# EasyEDA Pro project ZeptoWatch.eprj, schematic Schematic3
Create Date: 2022-11-16; Page Name: P1; Project Name: ZeptoWatch; Schematic Name: Schematic3; Update Date: 2022-11-27; Company: 嘉立创EDA; Page Size: A2; Version: V1.0
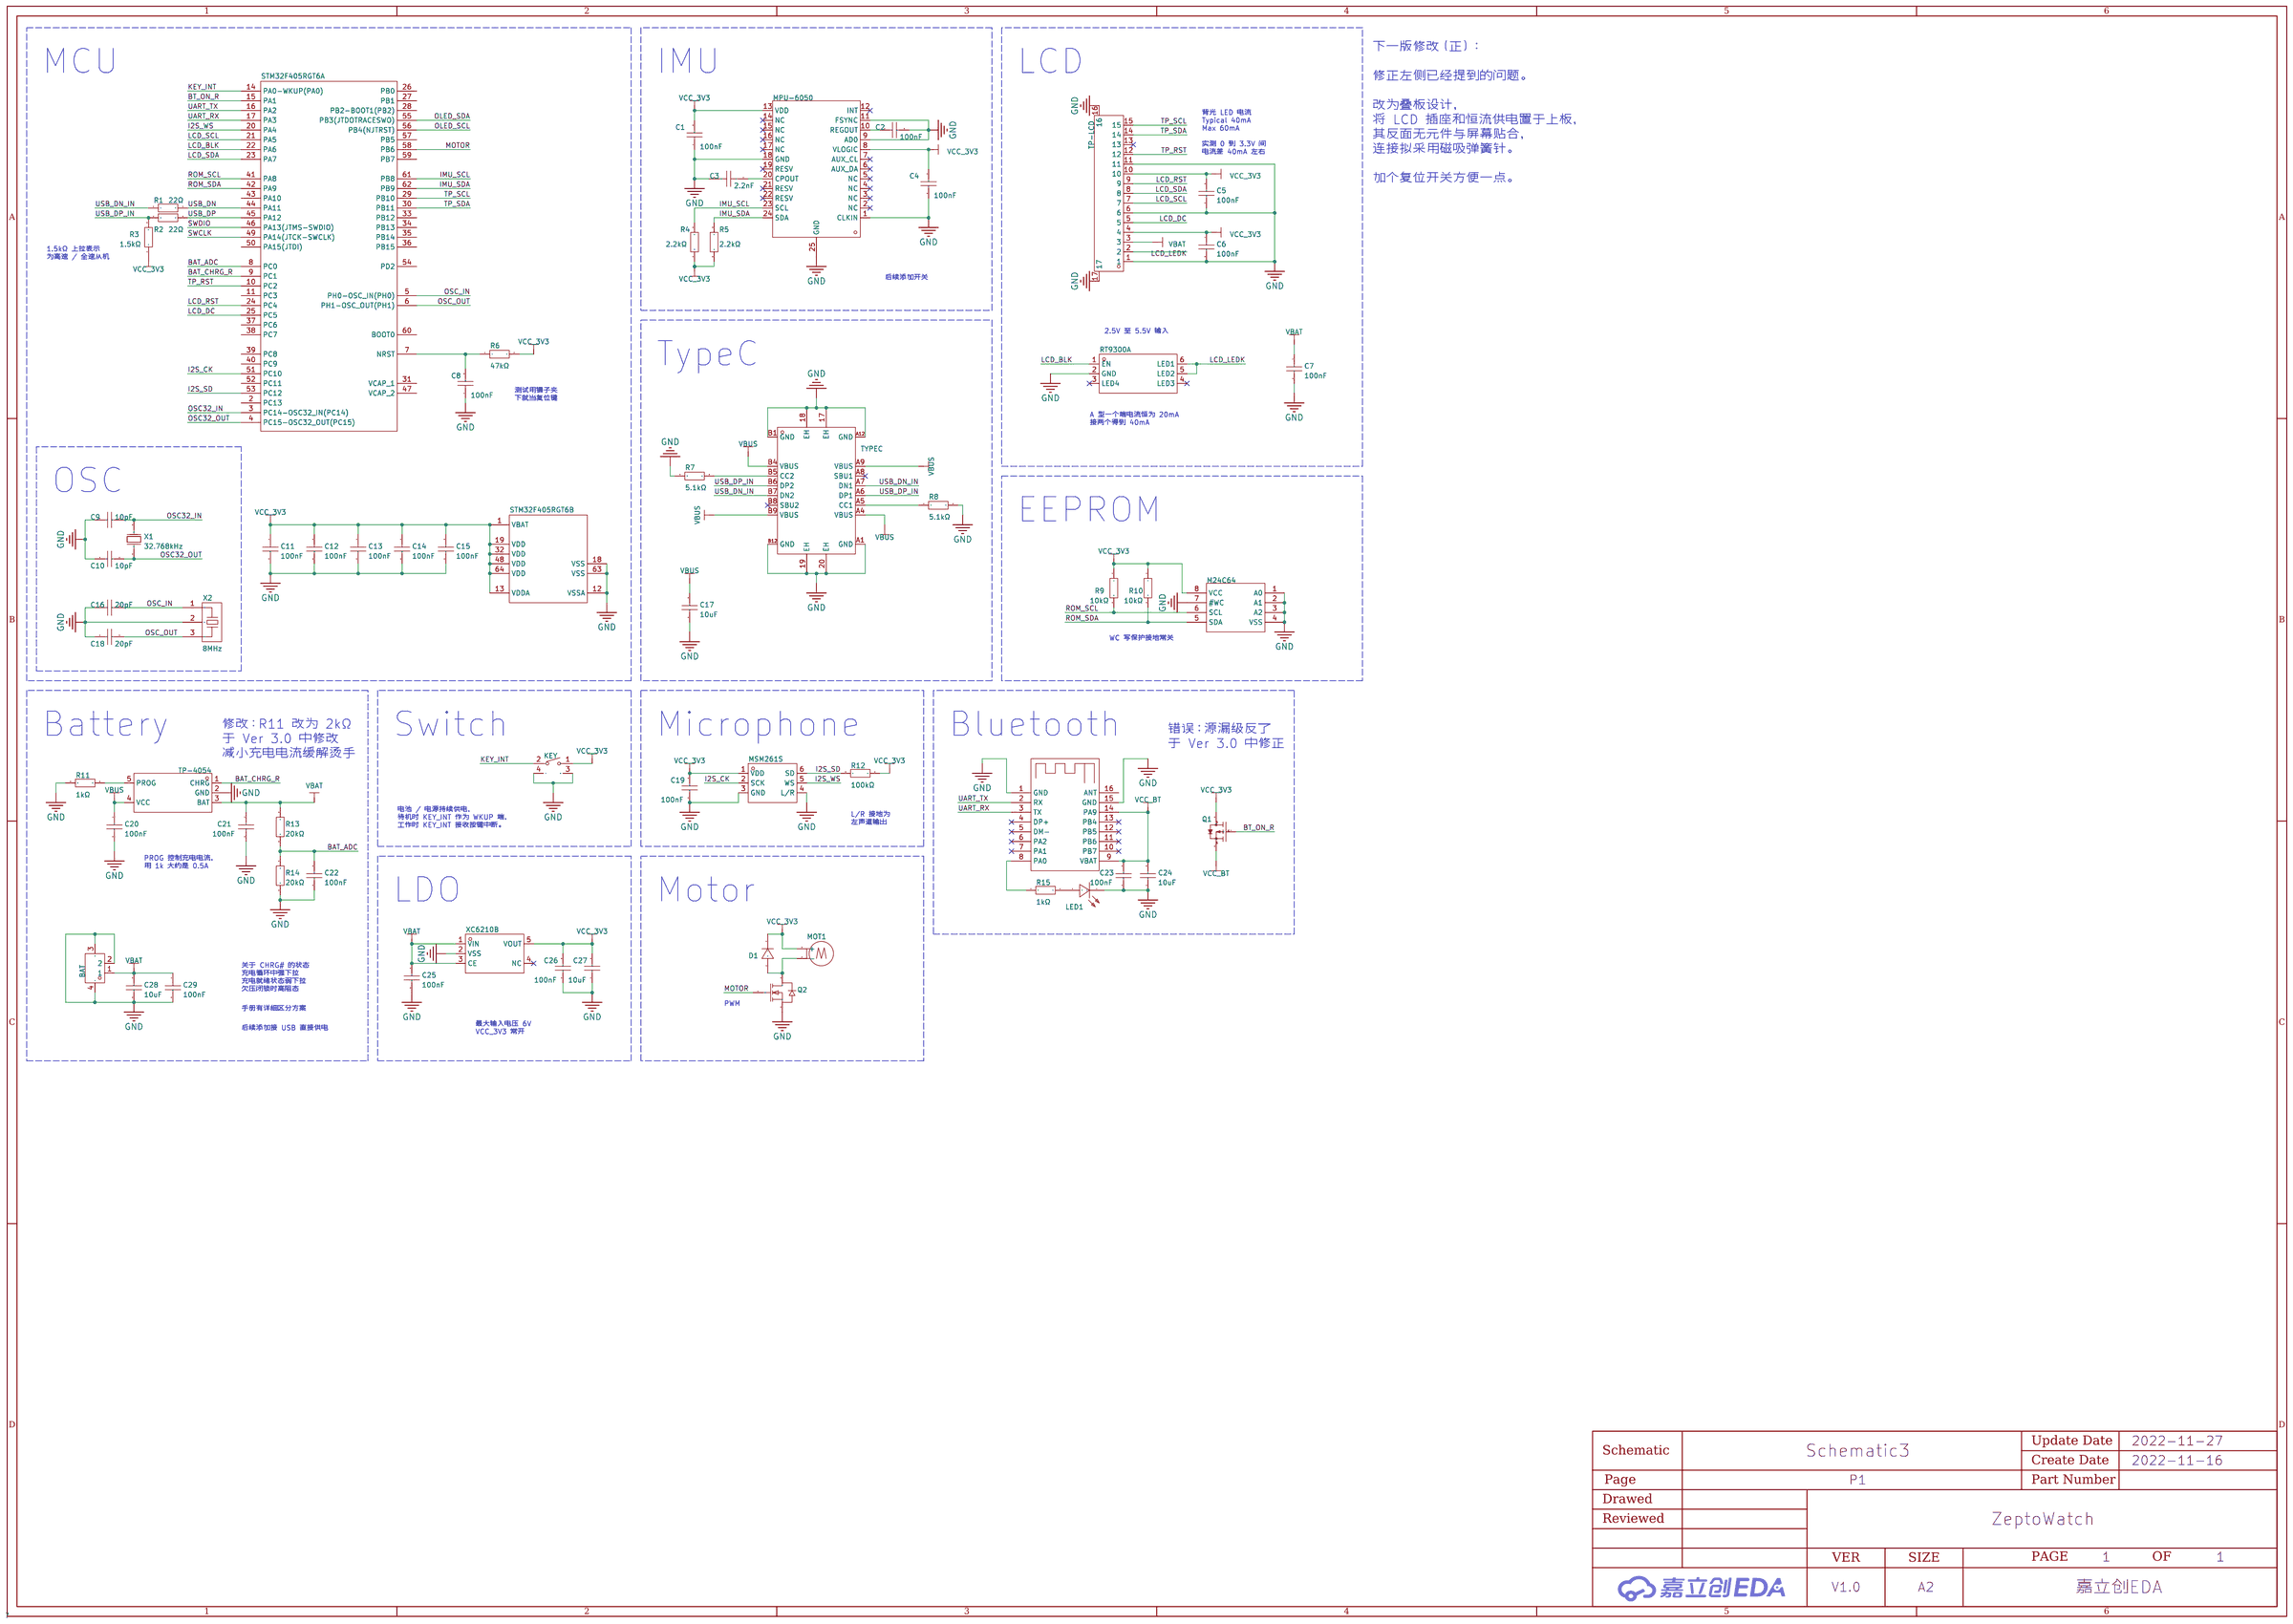
[diagram p2: schematic sheet]

## Parts
BAT  1.25K-CB-2PWB  [CONN-SMD_2P-P1.25_L5.5-W7.7-2PWB]
BT-11  -  [BT-11]
C1  100nF  [C0402]
C2  100nF  [C0402]
C3  2.2nF  [C0402]
C4  100nF  [C0402]
C5  100nF  [C0402]
C6  100nF  [C0402]
C7  100nF  [C0402]
C8  100nF  [C0402]
C9  10pF  [C0402]
C10  10pF  [C0402]
C11  100nF  [C0402]
C12  100nF  [C0402]
C13  100nF  [C0402]
C14  100nF  [C0402]
C15  100nF  [C0402]
C16  20pF  [C0402]
C17  10uF  [C0402]
C18  20pF  [C0402]
C19  100nF  [C0402]
C20  100nF  [C0402]
C21  100nF  [C0402]
C22  100nF  [C0402]
C23  100nF  [C0402]
C24  10uF  [C0402]
C25  100nF  [C0402]
C26  100nF  [C0402]
C27  10uF  [C0402]
C28  10uF  [C0402]
C29  100nF  [C0402]
D1  B5819WS  [SOD-323_L1.8-W1.3-LS2.5-FD]
KEY  TS-KG012EV  [SW-SMD_TS-KG012EV]
LED1  D-060306B1  [LED0603-RD]
M24C64  M24C64-RMN6TP  [SOIC-8_L5.0-W4.0-P1.27-LS6.0-BL]
MOT1  LCM1027A2445F  [VIBRATING-MOTOR-SMD_WELDING]
MPU-6050  MPU-6050  [QFN-24_L4.0-W4.0-P0.50-BL-EP2.7]
MSM261S  MSM261S3526Z0CM  [MIC-SMD_6P-L3.5-W2.7-P0.90-TR]
Q1  AO3401  [SOT-23-3_L2.9-W1.3-P1.90-LS2.4-BR]
Q2  AO3400A  [SOT-23-3_L2.9-W1.6-P1.90-LS2.8-BR]
R1  22Ω  [R0402]
R2  22Ω  [R0402]
R3  1.5kΩ  [R0402]
R4  2.2kΩ  [R0402]
R5  2.2kΩ  [R0402]
R6  47kΩ  [R0402]
R7  5.1kΩ  [R0402]
R8  5.1kΩ  [R0402]
R9  10kΩ  [R0402]
R10  10kΩ  [R0402]
R11  1kΩ  [R0402]
R12  100kΩ  [R0402]
R13  20kΩ  [R0402]
R14  20kΩ  [R0402]
R15  1kΩ  [R0402]
RT9300A  -  [SOT-23-6_L2.9-W1.6-P0.95-LS2.8-BR]
STM32F405RGT6  STM32F405RGT6  [LQFP-64_L10.0-W10.0-P0.50-LS12.0-BL]  (sections 1,2)
TP-4054  TP4054-42-SOT25R  [SOT-23-5_L3.0-W1.7-P0.95-LS2.8-BR]
TP-LCD  KH-FG0.5-H2.0-15PIN  [FPC-SMD_15P-P0.50_KINGHELM_KH-FG0.5-H2.0-15PIN]
TYPEC  TYPE-C-16M-005  [USB-C-SMD_TYPE-C-16M-005]
X1  32.768kHz  [OSC-SMD_L3.2-W1.5]
X2  8MHz  [OSC-SMD_3P-L3.2-W1.3-P1.2-L]
XC6210B  XC6210B332MR  [SOT-25_L3.0-W1.6-P0.95-LS2.8-BL]

## Library data of the parts
BAT = 1.25K-CB-2PWB: 参考系列:-;间距:1.25mm;插针结构:1x2P;排数:1;每排PIN数:2;行距:-;公母:公型插针;安装方式:卧贴;额定电流:1A;工作温度范围:-25~+85;; LCSC Part Name: 1x2P 间距P=1.25mm 超薄针座 超薄; Supplier Part: C2919570; Manufacturer: HDGC(华德共创); Supplier Footprint: SMD,P=1.25mm; JLCPCB Part Class: 扩展库; Datasheet: https://atta.szlcsc.com/upload/public/pdf/source/20211115/F776F48743F73668B48ED2809AC4027A.pdf; Supplier: LCSC; Pitch: 1.25mm; Pins Structure: 1x2P; Number of Rows: 1; Number of PINs Per Row: 2; Gender: 公型插针; Mounting Style: 卧贴; Current Rating (Max): 1A; Operating Temperature Range: -25~+85
BT-11 = BT-11
C1 C2 C4-C8 C11-C15 C19-C23 C25 C26 C29 = CC0402KRX7R9BB104: 容值:100nF;精度:±10%;额定电压:50V;材质(温度系数):X7R;; LCSC Part Name: 100nF ±10% 50V; Supplier Part: C131394; Manufacturer: YAGEO(国巨); Supplier Footprint: 0402; JLCPCB Part Class: 扩展库; Datasheet: https://atta.szlcsc.com/upload/public/pdf/source/20170925/C131394_1506321459057990237.pdf; Supplier: LCSC; Tolerance: ±10%; Voltage Rated: 50V; Temperature Coefficient: X7R
C3 = CC0402JRX7R9BB222: 温度系数:X7R;容值:2.2nF;电容体长:-;电容体宽:-;电容体厚度:-;精度:±5%;额定电压:50V;; LCSC Part Name: 2.2nF ±5% 50V; Supplier Part: C513667; Manufacturer: YAGEO(国巨); Supplier Footprint: 0402; JLCPCB Part Class: 扩展库; Datasheet: https://atta.szlcsc.com/upload/public/pdf/source/20200415/C513667_43ACA5E3BCCDD816EC65E9B61132137F.pdf; Supplier: LCSC; Temperature Coefficient: X7R; Tolerance: ±5%; Voltage Rated: 50V
C9 C10 = 0402CG100J500NT: 容值:10pF;精度:±5%;额定电压:50V;材质(温度系数):C0G;; LCSC Part Name: 10pF ±5% 50V; Supplier Part: C1545; Manufacturer: FH(风华); Supplier Footprint: 0402; JLCPCB Part Class: 扩展库; Datasheet: https://atta.szlcsc.com/upload/public/pdf/source/20170923/C1545_1506149264855988352.pdf; Supplier: LCSC; Tolerance: ±5%; Voltage Rated: 50V; Temperature Coefficient: C0G
C16 C18 = 0402CG200J500NT: 温度系数:C0G;容值:20pF;精度:±5%;额定电压:50V;; LCSC Part Name: 20pF(200) ±5% 50V; Supplier Part: C1554; Manufacturer: FH(风华); Supplier Footprint: 0402; JLCPCB Part Class: 基础库; Datasheet: https://atta.szlcsc.com/upload/public/pdf/source/20170923/C1554_1506149268708988361.pdf; Supplier: LCSC; Temperature Coefficient: C0G; Tolerance: ±5%; Voltage Rated: 50V
C17 C24 C27 C28 = CL05A106MQ5NUNC: 容值:10uF;精度:±20%;额定电压:6.3V;材质(温度系数):X5R;; LCSC Part Name: 10uF ±20% 6.3V; Supplier Part: C15525; Manufacturer: SAMSUNG(三星); Supplier Footprint: 0402; JLCPCB Part Class: 基础库; Datasheet: https://atta.szlcsc.com/upload/public/pdf/source/20220823/2B02EE04F8F211D38A52DCB16EB6BEBA.pdf; Supplier: LCSC; Tolerance: ±20%; Voltage Rated: 6.3V; Temperature Coefficient: X5R
D1 = B5819WS_C511873: 直流反向耐压(Vr):40V;平均整流电流(Io):1A;正向压降(Vf):900mV@3A;; LCSC Part Name: 40V 1A 900mV@3A; Supplier Part: C511873; Manufacturer: BORN伯恩半导体; Supplier Footprint: SOD-323; JLCPCB Part Class: 扩展库; Datasheet: https://atta.szlcsc.com/upload/public/pdf/source/20200413/C511871_84C991E4F87F9BC6B00A967897FF2061.pdf; Supplier: LCSC; Reverse Voltage (Vr): 40V; Average Rectified Current (Io): 1A; Forward Voltage (Vf@If): 900mV@3A
KEY = TS-KG012EV: 触点电流:50mA;额定电压(DC):12V;绝缘电阻:100MΩ;电路结构:单刀单掷;安装方式:卧插;按钮形状:矩形按钮;带灯:-;; LCSC Part Name: 轻触开关3*6*3.5侧按卧式 带柱; Supplier Part: C410363; Manufacturer: HANBO(汉博); Supplier Footprint: 插件,7.8x3.6x3.5mm; JLCPCB Part Class: 扩展库; Datasheet: https://atta.szlcsc.com/upload/public/pdf/source/20221110/2C1BC81D53AC7E4C4CC26C5BC87C8C3B.pdf; Supplier: LCSC; Contact Current: 50mA; Voltage Rating (DC): 12V; Insulation Resistance: 100MΩ; Circuit: 单刀单掷; Mounting Style: 卧插; Actuator Style: 矩形按钮
LED1 = D-060306B1: 发光颜色:蓝灯;; LCSC Part Name: 蓝色; Supplier Part: C118339; Manufacturer: 方舟 ARKLED; Supplier Footprint: 0603; JLCPCB Part Class: 扩展库; Datasheet: https://atta.szlcsc.com/upload/public/pdf/source/20190902/C118339_0F376D9FE53277D0A68A27C8339FB377.pdf; Supplier: LCSC; Emitted Color: 蓝灯
M24C64 = M24C64-RMN6TP: 存储器容量:64Kb (8K x 8);存储器接口类型:I2C;工作电压:1.8V ~ 5.5V;; Supplier Part: C79988; Manufacturer: ST(意法半导体); Supplier Footprint: SOIC-8_150mil; JLCPCB Part Class: 基础库; Datasheet: https://atta.szlcsc.com/upload/public/pdf/source/20160729/1469779585118.pdf; Supplier: LCSC; Memory Format: EEPROM; Memory Size: 64Kb (8K x 8); Memory Interface: I2C; Voltage - Supply: 1.8V ~ 5.5V
MOT1 = LCM1027A2445F: 类型:扁平振动马达;额定电压:3V;额定电流:80mA;额定转速:10000rpm;工作温度:-20~+60;旋转方向:CW；CCW;; LCSC Part Name: 扁平1027 振动马达; Supplier Part: C2759984; Manufacturer: LEADER(立得); JLCPCB Part Class: 扩展库; Datasheet: https://atta.szlcsc.com/upload/public/pdf/source/20210326/C2759984_5008EC97BD438BDFB6866D31635439F4.pdf; Supplier: LCSC; Type: 扁平振动马达; Rated Voltage: 3V; Rated Current: 80mA; Rated Speed: 10000rpm; Operating Temperature: -20~+60; Sense Of Rotation: CW；CCW
MPU-6050 = MPU-6050: 三轴加速度计和三轴陀螺仪，工作电压：2.375V~3.46V; Supplier Part: C24112; Manufacturer: TDK InvenSense(应美盛); Supplier Footprint: QFN-24_4x4x05P; JLCPCB Part Class: 扩展库; Datasheet: https://atta.szlcsc.com/upload/public/pdf/source/20140425/1457707046159.pdf; Supplier: LCSC
MSM261S = MSM261S3526Z0CM: Supplier Part: C966933; Manufacturer: MEMS(敏芯微); Supplier Footprint: SMD,3.5x2.65x0.98mm; JLCPCB Part Class: 扩展库; Datasheet: https://atta.szlcsc.com/upload/public/pdf/source/20210104/C966933_3269232C81BB891E12095FC7E88FC637.pdf; Supplier: LCSC
Q1 = AO3401_C181091: 类型:P沟道;漏源电压(Vdss):30V;连续漏极电流(Id):4.2A;功率(Pd):350mW;导通电阻(RDS(on)@Vgs,Id):65mΩ@10V,4.2A;阈值电压(Vgs(th)@Id):1.3V@250A;; LCSC Part Name: P沟道 30V 4.2A; Supplier Part: C181091; Manufacturer: Hottech(合科泰); Supplier Footprint: SOT-23(SOT-23-3); JLCPCB Part Class: 扩展库; Datasheet: https://atta.szlcsc.com/upload/public/pdf/source/20180131/C181091_15173931948391329220.pdf; Supplier: LCSC; Type: P沟道; Drain Source Voltage (Vdss): 30V; Continuous Drain Current (Id): 4.2A; Power Dissipation (Pd): 350mW; Drain Source On Resistance (RDS(on)@Vgs,Id): 65mΩ@10V,4.2A; Gate Threshold Voltage (Vgs(th)@Id): 1.3V@250A
Q2 = AO3400A_C20917: 类型:N沟道;漏源电压(Vdss):30V;连续漏极电流(Id):5.7A;功率(Pd):1.4W;导通电阻(RDS(on)@Vgs,Id):26.5mΩ@10V,5.7A;阈值电压(Vgs(th)@Id):1.5V@250A;; LCSC Part Name: N沟道 30V 5.7A; Supplier Part: C20917; Manufacturer: AOS; Supplier Footprint: SOT-23-3L; JLCPCB Part Class: 基础库; Datasheet: https://atta.szlcsc.com/upload/public/pdf/source/20140107/1457706668533.pdf; Supplier: LCSC; Type: N沟道; Drain Source Voltage (Vdss): 30V; Continuous Drain Current (Id): 5.7A; Power Dissipation (Pd): 1.4W; Drain Source On Resistance (RDS(on)@Vgs,Id): 26.5mΩ@10V,5.7A; Gate Threshold Voltage (Vgs(th)@Id): 1.5V@250A
R1 R2 = CR0402FF22R0G: 电阻类型:厚膜电阻;阻值:22Ω;精度:±1%;功率:1/16W;温度系数:±200ppm/;最大工作电压:50V;工作温度范围:-55~+125;; LCSC Part Name: 22Ω ±1%; Supplier Part: C100318; Manufacturer: LIZ(丽智电子); Supplier Footprint: 0402; Datasheet: https://atta.szlcsc.com/upload/public/pdf/source/20170408/1491621411980.pdf; Supplier: LCSC; Type: 厚膜电阻; Tolerance: ±1%; Power(Watts): 1/16W; Temperature Coefficient: ±200ppm/; Overload Voltage (Max): 50V; Operating Temperature Range: -55~+125
R3 = 0402WGF1501TCE: 阻值:1.5kΩ;精度:±1%;功率:1/16W;温度系数:±100ppm/;最大工作电压:50V;工作温度范围:-55~+155;; LCSC Part Name: 1.5KΩ ±1%; Supplier Part: C25867; Manufacturer: UNI-ROYAL(厚声); Supplier Footprint: 0402; JLCPCB Part Class: 基础库; Datasheet: https://atta.szlcsc.com/upload/public/pdf/source/20170920/C25867_1505895090394980874.pdf; Supplier: LCSC; Tolerance: ±1%; Power(Watts): 1/16W; Temperature Coefficient: ±100ppm/; Overload Voltage (Max): 50V; Operating Temperature Range: -55~+155
R4 R5 = RMC04022.2K5%N: 阻值:2.2kΩ;精度:±5%;功率:1/16W;; LCSC Part Name: 2.2kΩ ±5%; Supplier Part: C269678; Manufacturer: Tyohm(幸亚电阻); Supplier Footprint: 0402; JLCPCB Part Class: 扩展库; Datasheet: https://atta.szlcsc.com/upload/public/pdf/source/20190115/C269678_CFD168C224D6BF2B41E71AA235945392.pdf; Supplier: LCSC; Tolerance: ±5%; Power(Watts): 1/16W
R6 = 0402WGF4702TCE: 电阻类型:厚膜电阻;阻值:47kΩ;精度:±1%;功率:62.5mW;温度系数:±100ppm/;最大工作电压:50V;工作温度范围:-55~+155;; LCSC Part Name: 47kΩ ±1% 62.5mW; Supplier Part: C25792; Manufacturer: UNI-ROYAL(厚声); Supplier Footprint: 0402; JLCPCB Part Class: 基础库; Datasheet: https://atta.szlcsc.com/upload/public/pdf/source/20200306/C422600_1E6D84923E4A46A82E41ADD87F860B5C.pdf; Supplier: LCSC; Type: 厚膜电阻; Tolerance: ±1%; Power(Watts): 62.5mW; Temperature Coefficient: ±100ppm/; Overload Voltage (Max): 50V; Operating Temperature Range: -55~+155
R7 R8 = RC0402FR-075K1L: 阻值:5.1kΩ;精度:±1%;功率:62.5mW;温度系数:±100ppm/;最大工作电压:50V;工作温度范围:-55~+155;; LCSC Part Name: 5.1kΩ ±1% 62.5mW; Supplier Part: C105872; Manufacturer: YAGEO(国巨); Supplier Footprint: 0402; JLCPCB Part Class: 扩展库; Datasheet: https://atta.szlcsc.com/upload/public/pdf/source/20170912/C105872_1505207464555963229.pdf; Supplier: LCSC; Tolerance: ±1%; Power(Watts): 62.5mW; Temperature Coefficient: ±100ppm/; Overload Voltage (Max): 50V; Operating Temperature Range: -55~+155
R9 R10 = 0402WGF1002TCE: 电阻类型:厚膜电阻;阻值:10kΩ;精度:±1%;功率:62.5mW;温度系数:±100ppm/;最大工作电压:50V;工作温度范围:-55~+155;; LCSC Part Name: 10kΩ ±1% 62.5mW; Supplier Part: C25744; Manufacturer: UNI-ROYAL(厚声); Supplier Footprint: 0402; JLCPCB Part Class: 基础库; Datasheet: https://atta.szlcsc.com/upload/public/pdf/source/20200306/C422600_1E6D84923E4A46A82E41ADD87F860B5C.pdf; Supplier: LCSC; Type: 厚膜电阻; Tolerance: ±1%; Power(Watts): 62.5mW; Temperature Coefficient: ±100ppm/; Overload Voltage (Max): 50V; Operating Temperature Range: -55~+155
R11 R15 = 0402WGF1001TCE: 电阻类型:厚膜电阻;阻值:1kΩ;精度:±1%;功率:62.5mW;温度系数:±100ppm/;最大工作电压:50V;工作温度范围:-55~+155;; LCSC Part Name: 1kΩ ±1% 62.5mW; Supplier Part: C11702; Manufacturer: UNI-ROYAL(厚声); Supplier Footprint: 0402; JLCPCB Part Class: 基础库; Datasheet: https://atta.szlcsc.com/upload/public/pdf/source/20200306/C422600_1E6D84923E4A46A82E41ADD87F860B5C.pdf; Supplier: LCSC; Type: 厚膜电阻; Tolerance: ±1%; Power(Watts): 62.5mW; Temperature Coefficient: ±100ppm/; Overload Voltage (Max): 50V; Operating Temperature Range: -55~+155
R12 = AC0402FR-07100KL: 电阻类型:厚膜电阻;阻值:100kΩ;精度:±1%;功率:62.5mW;温度系数:±100ppm/;最大工作电压:50V;工作温度范围:-55~+155;; LCSC Part Name: 100kΩ ±1%; Supplier Part: C144809; Manufacturer: YAGEO(国巨); Supplier Footprint: 0402; JLCPCB Part Class: 扩展库; Datasheet: https://atta.szlcsc.com/upload/public/pdf/source/20171225/C144809_15141880836601203001.pdf; Supplier: LCSC; Type: 厚膜电阻; Tolerance: ±1%; Power(Watts): 62.5mW; Temperature Coefficient: ±100ppm/; Overload Voltage (Max): 50V; Operating Temperature Range: -55~+155
R13 R14 = RC-02W203JT: 阻值:20kΩ;精度:±5%;功率:62.5mW;温度系数:±200ppm/;最大工作电压:50V;工作温度范围:-55~+155;; LCSC Part Name: 20kΩ ±5% 62.5mW; Supplier Part: C258120; Manufacturer: FH(风华); Supplier Footprint: 0402; JLCPCB Part Class: 扩展库; Datasheet: https://atta.szlcsc.com/upload/public/pdf/source/20180730/C258120_EB2ABA5B79561D80B536831B08AD21D8.pdf; Supplier: LCSC; Tolerance: ±5%; Power(Watts): 62.5mW; Temperature Coefficient: ±200ppm/; Overload Voltage (Max): 50V; Operating Temperature Range: -55~+155
RT9300A = RT9300AGE: 类型:-;拓扑结构:-;内部开关:-;供电电压（最低）:-;供电电压（最高）:-;频率:-;; Supplier Part: C68151; Manufacturer: RICHTEK(台湾立锜); Supplier Footprint: SOT-23-6; JLCPCB Part Class: 扩展库; Datasheet: https://atta.szlcsc.com/upload/public/pdf/source/20180420/C68151_339603FDACFBF870F6D423A94B86B684.pdf; Supplier: LCSC
STM32F405RGT6 = STM32F405RGT6: 主频（MAX):168MHz;工作电压:1.8V ~ 3.6V;; Supplier Part: C15742; Manufacturer: ST(意法半导体); Supplier Footprint: LQFP-64_10x10x05P; JLCPCB Part Class: 扩展库; Datasheet: https://atta.szlcsc.com/upload/public/pdf/source/20140724/1457707160365.pdf; Supplier: LCSC; Speed: 168MHz; Voltage - Supply (Vcc/Vdd): 1.8V ~ 3.6V; Program Memory Size: 1MB; RAM Size: 192KB; Number of I/O: 51; A/D: 16x12bit; D/A: 2x12bit; PWM: 56; LCD: MOTOROLA 6800 AND INTEL  8080 TYPE LCD DIRECTLY; UART/USART: 4 USART+2 UART; SPI: 3; I2C（SMBUS/PMBUS）: 3; USB Device: 1; USB Host/OTG: 1; CAN: 2
TP-4054 = TP4054-42-SOT25R: 充电电池的类型:-;电池单元组数:-;最大充电电流:-;充满的电池组电压:-;最大供应电压:-;; Supplier Part: C32574; Manufacturer: TOPPOWER(南京拓微); Supplier Footprint: SOT-23-5; JLCPCB Part Class: 基础库; Datasheet: https://atta.szlcsc.com/upload/public/pdf/source/20140621/1457707095588.pdf; Supplier: LCSC
TP-LCD = KH-FG0.5-H2.0-15PIN: 间距:0.5mm;触点数量:15;锁定特性:翻盖式;安装类型:卧贴;触点类型:下接;工作温度范围:-25~+85;; LCSC Part Name: 0.5mm P数:15 翻盖式 下接; Supplier Part: C2925370; Manufacturer: kinghelm(金航标); Supplier Footprint: SMD,P=0.5mm; JLCPCB Part Class: 扩展库; Datasheet: https://atta.szlcsc.com/upload/public/pdf/source/20211126/ADAA9B198F87BAF60DF8D38208290934.pdf; Supplier: LCSC; Pitch: 0.5mm; Number of Contacts: 15; Locking Feature: 翻盖式; Mounting Type: 卧贴; Contact Type: 下接; Height Above Board: 2mm; FFC, FCB Thickness: 0.3mm; Operating Temperature Range: -25~+85
TYPEC = TYPE-C-16M-005: 连接器类型:-;标准:-;公母:-;触点数量:-;端口数量:-;安装方式:-;额定电流 - 电源:-;触头材质:-;触头镀层:-;工作温度范围:-;; Supplier Part: C2798173; Manufacturer: USAKRO(美韩); Supplier Footprint: SMD; Datasheet: https://atta.szlcsc.com/upload/public/pdf/source/20210415/C2798173_AFB22F19D04D65557371BF612B0225CF.pdf; Supplier: LCSC
X1 = X1A000141000300: 晶振类型:贴片无源晶振;频率:32.768kHz;频率公差:±20ppm;负载电容:12.5pF;等效串联电阻(ESR):-;工作温度:-40~+85;; LCSC Part Name: 32.768kHz ±20ppm 12.5pF; Supplier Part: C94276; Manufacturer: EPSON(爱普生); Supplier Footprint: SMD3215-2P; JLCPCB Part Class: 扩展库; Datasheet: https://atta.szlcsc.com/upload/public/pdf/source/20190322/C94276_5F77F140A1A8611EFF35496F1E5C1546.pdf; Supplier: LCSC; Crystal Type: 贴片无源晶振; Frequency Tolerance: ±20ppm; Load Capacitance: 12.5pF; Operating Temperature: -40~+85
X2 = CSTCE8M00G15C99-R0: 频率:8MHz;频率容差:±0.1%;内藏负载电容:33pF;谐振阻抗:40Ω;; LCSC Part Name: 8M ±0.1% 33pF; Supplier Part: C110614; Manufacturer: muRata(村田); Supplier Footprint: SMD3213-3P; JLCPCB Part Class: 扩展库; Datasheet: https://atta.szlcsc.com/upload/public/pdf/source/20180327/C110614_9F5031E08ADB10DE4472527BF78A8CAF.pdf; Supplier: LCSC; Frequency Stability: ±0.13%; Frequency Tolerance: ±0.1%; Built-in Load Capacitance: 33pF; Resonant Impedance: 40Ω; Operating Temperature: -40~+125
XC6210B = XC6210B332MR_C424705: 输出类型:固定;输出极性:正;输出通道数:1;最大输入电压:6V;输出电压:3.3V;压差:75mV@(100mA);输出电流:900mA;电源纹波抑制比(PRSS):60dB@(1kHz);; LCSC Part Name: Vin=6V Vout=3.3V 900mA 60dB@(1kHz); Supplier Part: C424705; Manufacturer: TOREX(特瑞仕); Supplier Footprint: SOT-25; JLCPCB Part Class: 扩展库; Datasheet: https://atta.szlcsc.com/upload/public/pdf/source/20190903/C424705_1DFB2113A9A78D399905DBF688657204.pdf; Supplier: LCSC; Output Type: 固定; Output Polarity: 正; Number of Outputs: 1; Maximum Input Voltage: 6V; Output Voltage: 3.3V; Dropout Voltage: 75mV@(100mA); Output Current: 900mA; Power Supply Rejection Ratio (PRSS): 60dB@(1kHz)

## Nets
GND: BAT.2 BAT.3 BAT.4 BT-11.1(GND) BT-11.15(GND) C1.1 C2.2 C3.2 C4.1 C5.2 C6.2 C7.2 C8.1 C9.1 C10.1 C11.2 C12.2 C13.2 C14.2 C15.1 C16.1 C17.1 C18.1 C19.2 C20.2 C21.2 C22.2 C23.2 C24.1 C25.2 C26.2 C27.1 C28.1 C29.2 KEY.3 KEY.4 LED1.1 M24C64.1(A0) M24C64.2(A1) M24C64.3(A2) M24C64.4(VSS) M24C64.7(#WC) MPU-6050.1(CLKIN) MPU-6050.9(AD0) MPU-6050.11(FSYNC) MPU-6050.18(GND) MPU-6050.25(GND) MSM261S.3(GND) MSM261S.4(L/R) Q2.2(S) R7.1 R8.2 R11.2 R14.2 RT9300A.2(GND) STM32F405RGT6.12(VSSA) STM32F405RGT6.18(VSS) STM32F405RGT6.63(VSS) TP-4054.2(GND) TP-LCD.1 TP-LCD.6 TP-LCD.11 TP-LCD.16 TP-LCD.17 TYPEC.17(EH) TYPEC.18(EH) TYPEC.19(EH) TYPEC.20(EH) TYPEC.A1(GND) TYPEC.A12(GND) TYPEC.B1(GND) TYPEC.B12(GND) X2.2 XC6210B.2(VSS)
VBAT: BAT.1 C7.1 C21.1 C25.1 C28.2 C29.1 R13.1 TP-4054.3(BAT) TP-LCD.3 XC6210B.1(VIN) XC6210B.3(CE)
VBUS: C17.2 C20.1 TP-4054.4(VCC) TYPEC.A4(VBUS) TYPEC.A9(VBUS) TYPEC.B4(VBUS) TYPEC.B9(VBUS)
VCC_3V3: C1.2 C4.2 C5.1 C6.1 C11.1 C12.1 C13.1 C14.1 C15.2 C19.1 C26.1 C27.2 D1.2(K) KEY.1 M24C64.8(VCC) MOT1.2(+) MPU-6050.8(VLOGIC) MPU-6050.13(VDD) MSM261S.1(VDD) Q1.3(D) R3.1 R4.1 R5.1 R6.2 R9.1 R10.1 R12.1 STM32F405RGT6.1(VBAT) STM32F405RGT6.13(VDDA) STM32F405RGT6.19(VDD) STM32F405RGT6.32(VDD) STM32F405RGT6.48(VDD) STM32F405RGT6.64(VDD) TP-LCD.4 TP-LCD.10 XC6210B.5(VOUT)
VCC_BT: BT-11.9(VBAT) BT-11.14(PA9) C23.1 C24.2 Q1.2(S)
BAT_ADC: C22.1 R13.2 R14.1 STM32F405RGT6.8(PC0)
BAT_CHRG_R: STM32F405RGT6.9(PC1) TP-4054.1(CHRG)
BT_ON_R: Q1.1(G) STM32F405RGT6.15(PA1)
I2S_CK: MSM261S.2(SCK) STM32F405RGT6.51(PC10)
I2S_SD: MSM261S.6(SD) R12.2 STM32F405RGT6.53(PC12)
I2S_WS: MSM261S.5(WS) STM32F405RGT6.20(PA4)
IMU_SCL: MPU-6050.23(SCL) R4.2 STM32F405RGT6.61(PB8)
IMU_SDA: MPU-6050.24(SDA) R5.2 STM32F405RGT6.62(PB9)
KEY_INT: KEY.2 STM32F405RGT6.14(PA0-WKUP(PA0))
LCD_BLK: RT9300A.1(EN) STM32F405RGT6.22(PA6)
LCD_DC: STM32F405RGT6.25(PC5) TP-LCD.5
LCD_LEDK: RT9300A.5(LED2) RT9300A.6(LED1) TP-LCD.2
LCD_RST: STM32F405RGT6.24(PC4) TP-LCD.9
LCD_SCL: STM32F405RGT6.21(PA5) TP-LCD.7
LCD_SDA: STM32F405RGT6.23(PA7) TP-LCD.8
MOTOR: Q2.1(G) STM32F405RGT6.58(PB6)
OLED_SCL: STM32F405RGT6.56(PB4(NJTRST))
OLED_SDA: STM32F405RGT6.55(PB3(JTDOTRACESWO))
OSC32_IN: C9.2 STM32F405RGT6.3(PC14-OSC32_IN(PC14)) X1.2(OSC2)
OSC32_OUT: C10.2 STM32F405RGT6.4(PC15-OSC32_OUT(PC15)) X1.1(OSC1)
OSC_IN: C16.2 STM32F405RGT6.5(PH0-OSC_IN(PH0)) X2.1
OSC_OUT: C18.2 STM32F405RGT6.6(PH1-OSC_OUT(PH1)) X2.3
ROM_SCL: M24C64.6(SCL) R9.2 STM32F405RGT6.41(PA8)
ROM_SDA: M24C64.5(SDA) R10.2 STM32F405RGT6.42(PA9)
SWCLK: STM32F405RGT6.49(PA14(JTCK-SWCLK))
SWDIO: STM32F405RGT6.46(PA13(JTMS-SWDIO))
TP_RST: STM32F405RGT6.10(PC2) TP-LCD.12
TP_SCL: STM32F405RGT6.29(PB10) TP-LCD.15
TP_SDA: STM32F405RGT6.30(PB11) TP-LCD.14
UART_RX: BT-11.3(TX) STM32F405RGT6.17(PA3)
UART_TX: BT-11.2(RX) STM32F405RGT6.16(PA2)
USB_DN: R1.2 STM32F405RGT6.44(PA11)
USB_DN_IN: R1.1 TYPEC.A7(DN1) TYPEC.B7(DN2)
USB_DP: R2.2 STM32F405RGT6.45(PA12)
USB_DP_IN: R2.1 R3.2 TYPEC.A6(DP1) TYPEC.B6(DP2)
$1N4163: C2.1 MPU-6050.10(REGOUT)
$1N4165: C3.1 MPU-6050.20(CPOUT)
$1N4208: R7.2 TYPEC.B5(CC2)
$1N4211: R8.1 TYPEC.A5(CC1)
$1N92743: BT-11.8(PA0) R15.2
$1N93624: LED1.2 R15.1
$1N104069: D1.1(A) MOT1.1(-) Q2.3(D)
$1N121928: R11.1 TP-4054.5(PROG)
Net-(C8-2): C8.2 R6.1 STM32F405RGT6.7(NRST)

Not connected (* = marked no-connect by the designer): BT-11 4(DP+)* 5(DM-)* 6(PA2)* 7(PA1)* 10(PB7)* 11(PB6)* 12(PB5)* 13(PB4)* 16(ANT); MPU-6050 2(NC)* 3(NC)* 4(NC)* 5(NC)* 6(AUX_DA)* 7(AUX_CL)* 12(INT)* 14(NC)* 15(NC)* 16(NC)* 17(NC)* 19(RESV)* 21(RESV)* 22(RESV)*; RT9300A 3(LED4)* 4(LED3)*; STM32F405RGT6 2(PC13) 11(PC3) 26(PB0) 27(PB1) 28(PB2-BOOT1(PB2)) 31(VCAP_1) 33(PB12) 34(PB13) 35(PB14) 36(PB15) 37(PC6) 38(PC7) 39(PC8) 40(PC9) 43(PA10) 47(VCAP_2) 50(PA15(JTDI)) 52(PC11) 54(PD2) 57(PB5) 59(PB7) 60(BOOT0); TP-LCD 13*; TYPEC A8(SBU1)* B8(SBU2)*; XC6210B 4(NC)*

## Notes on the sheet
- 下一版修改（正）：
  修正左侧已经提到的问题。
  改为叠板设计，
  将 LCD 插座和恒流供电置于上板，
  其反面无元件与屏幕贴合，
  连接拟采用磁吸弹簧针。
  加个复位开关方便一点。
- MCU
- IMU
- LCD
- 背光 LED 电流
  Typical 40mA
  Max 60mA
  实测 0 到 3.3V 间
  电流差 40mA 左右
- 1.5kΩ 上拉表示
  为高速 / 全速从机
- 后续添加开关
- 2.5V 至 5.5V 输入
- TypeC
- 测试用镊子夹
  下就当复位键
- A 型一个端电流恒为 20mA
  接两个得到 40mA
- OSC
- EEPROM
- WC 写保护接地常关
- 修改：R11 改为 2kΩ
  于 Ver 3.0 中修改
  减小充电电流缓解烫手
- 错误：源漏级反了
  于 Ver 3.0 中修正
- Battery
- Switch
- Microphone
- Bluetooth
- 电池 / 电源持续供电，
  待机时 KEY_INT 作为 WKUP 端，
  工作时 KEY_INT 接收按键中断。
- L/R 接地为
  左声道输出
- PROG 控制充电电流，
  用 1k 大约是 0.5A
- LDO
- Motor
- 关于 CHRG# 的状态
  充电循环中强下拉
  充电就绪状态弱下拉
  欠压闭锁时高阻态
- PWM
- 手册有详细区分方案
- 最大输入电压 6V
  VCC_3V3 常开
- 后续添加接 USB 直接供电
